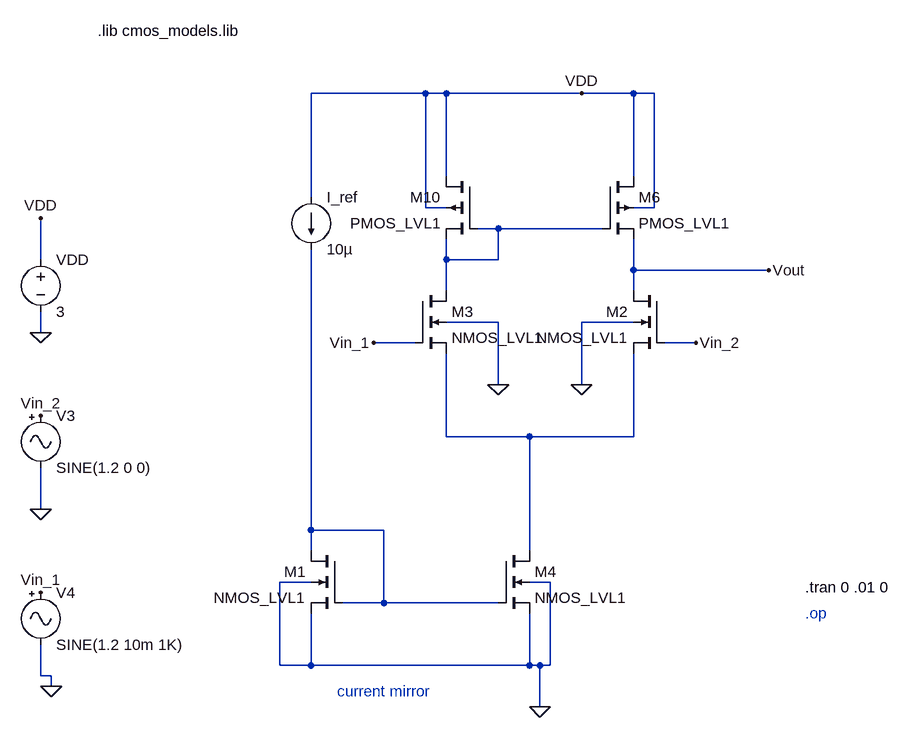
[diagram p0: schematic diff_amp_w_current_mirror.asc]
diff_amp_w_current_mirror.asc, the LTspice schematic file:
Version 4.1
SHEET 1 1580 680
WIRE 544 -432 368 -432
WIRE 576 -432 544 -432
WIRE 784 -432 576 -432
WIRE 864 -432 784 -432
WIRE 896 -432 864 -432
WIRE 576 -304 576 -432
WIRE 864 -304 864 -432
WIRE 368 -272 368 -432
WIRE 544 -256 544 -432
WIRE 576 -256 544 -256
WIRE 896 -256 896 -432
WIRE 896 -256 864 -256
WIRE 656 -224 624 -224
WIRE 816 -224 656 -224
WIRE -48 -176 -48 -240
WIRE 576 -176 576 -208
WIRE 656 -176 656 -224
WIRE 656 -176 576 -176
WIRE 864 -160 864 -208
WIRE 1072 -160 864 -160
WIRE 576 -128 576 -176
WIRE 864 -128 864 -160
WIRE 656 -80 576 -80
WIRE 864 -80 784 -80
WIRE -48 -64 -48 -96
WIRE 528 -48 464 -48
WIRE 960 -48 912 -48
WIRE 656 16 656 -80
WIRE 784 16 784 -80
WIRE 576 96 576 -32
WIRE 704 96 576 96
WIRE 864 96 864 -32
WIRE 864 96 704 96
WIRE -48 208 -48 144
WIRE 368 240 368 -192
WIRE 480 240 368 240
WIRE 368 272 368 240
WIRE 704 272 704 96
WIRE 368 320 320 320
WIRE 736 320 704 320
WIRE 480 352 480 240
WIRE 480 352 416 352
WIRE 656 352 480 352
WIRE 320 448 320 320
WIRE 368 448 368 368
WIRE 368 448 320 448
WIRE 704 448 704 368
WIRE 704 448 368 448
WIRE 720 448 704 448
WIRE 736 448 736 320
WIRE 736 448 720 448
WIRE -48 464 -48 416
WIRE -32 464 -48 464
WIRE -32 480 -32 464
WIRE 720 512 720 448
FLAG -48 -240 VDD
FLAG -48 -64 0
FLAG 784 -432 VDD
FLAG 720 512 0
FLAG 464 -48 Vin_1
FLAG 960 -48 Vin_2
FLAG 656 16 0
FLAG 784 16 0
FLAG 1072 -160 Vout
FLAG -48 208 0
FLAG -32 480 0
FLAG -48 336 Vin_1
FLAG -48 64 Vin_2
DATAFLAG 704 176 ""
DATAFLAG 576 -176 ""
SYMBOL voltage -48 -192 R0
WINDOW 123 0 0 Left 0
WINDOW 39 0 0 Left 0
SYMATTR InstName VDD
SYMATTR Value 3
SYMBOL current 368 -272 R0
WINDOW 123 0 0 Left 0
WINDOW 39 0 0 Left 0
SYMATTR InstName I_ref
SYMATTR Value 10µ
SYMBOL nmos4 416 272 M0
SYMATTR InstName M1
SYMATTR Value NMOS_LVL1
SYMATTR Value2 l=5u w=5u
SYMBOL nmos4 912 -128 M0
SYMATTR InstName M2
SYMATTR Value NMOS_LVL1
SYMATTR Value2 l=5u w=5u
SYMBOL nmos4 528 -128 R0
SYMATTR InstName M3
SYMATTR Value NMOS_LVL1
SYMATTR Value2 l=5u w=5u
SYMBOL nmos4 656 272 R0
SYMATTR InstName M4
SYMATTR Value NMOS_LVL1
SYMATTR Value2 l=5u w=5u
SYMBOL pmos4 816 -304 R0
SYMATTR InstName M6
SYMATTR Value PMOS_LVL1
SYMATTR Value2 l=5u w=5u
SYMBOL pmos4 624 -304 M0
SYMATTR InstName M10
SYMATTR Value PMOS_LVL1
SYMATTR Value2 l=5u w=5u
SYMBOL Misc\\signal -48 48 R0
WINDOW 123 0 0 Left 0
WINDOW 39 0 0 Left 0
SYMATTR InstName V3
SYMATTR Value SINE(1.2 0 0)
SYMBOL Misc\\signal -48 320 R0
WINDOW 123 0 0 Left 0
WINDOW 39 0 0 Left 0
SYMATTR InstName V4
SYMATTR Value SINE(1.2 10m 1K)
TEXT 40 -528 Left 2 !.lib cmos_models.lib
TEXT 408 488 Left 2 ;current mirror
TEXT 1128 328 Left 2 !.tran 0 .01 0
TEXT 1128 368 Left 2 ;.op

The netlist it stands for:
* diff_amp_w_current_mirror.asc
VDD VDD 0 3
I_ref VDD N003 10µ
M1 N003 N003 0 0 NMOS_LVL1 l=5u w=5u
M2 Vout Vin_2 N002 0 NMOS_LVL1 l=5u w=5u
M3 N001 Vin_1 N002 0 NMOS_LVL1 l=5u w=5u
M4 N002 N003 0 0 NMOS_LVL1 l=5u w=5u
M6 VDD N001 Vout VDD PMOS_LVL1 l=5u w=5u
M10 VDD N001 N001 VDD PMOS_LVL1 l=5u w=5u
V3 Vin_2 0 SINE(1.2 0 0)
V4 Vin_1 0 SINE(1.2 10m 1K)
.model NMOS NMOS
.model PMOS PMOS
.lib standard.mos
.lib cmos_models.lib
* current mirror
.tran 0 .01 0
* .op
.backanno
.end

* Results of the author's LTspice run, read from the files saved beside the schematic
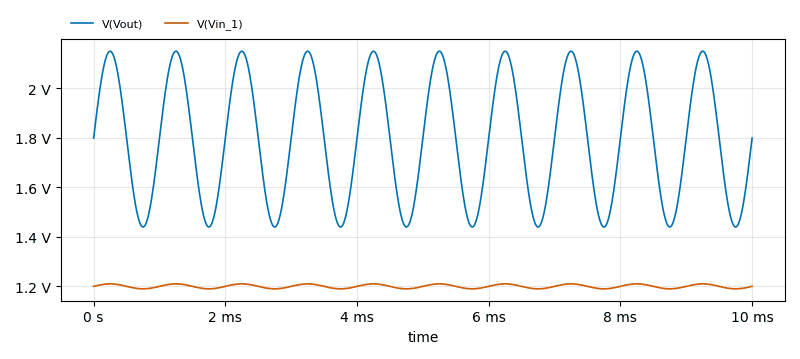
[diagram p1: Transient Analysis of diff_amp_w_current_mirror.asc, plotted from the saved traces]
* Transient Analysis, 1 run:
*   V(Vout): min 1.44 V, max 2.149 V, average 1.796 V, rms 1.814 V, last 1.798 V
*   V(Vin_1): min 1.19 V, max 1.21 V, average 1.2 V, rms 1.2 V, last 1.2 V